# Altium schematic sheet NixieSocket.SchDoc
size A
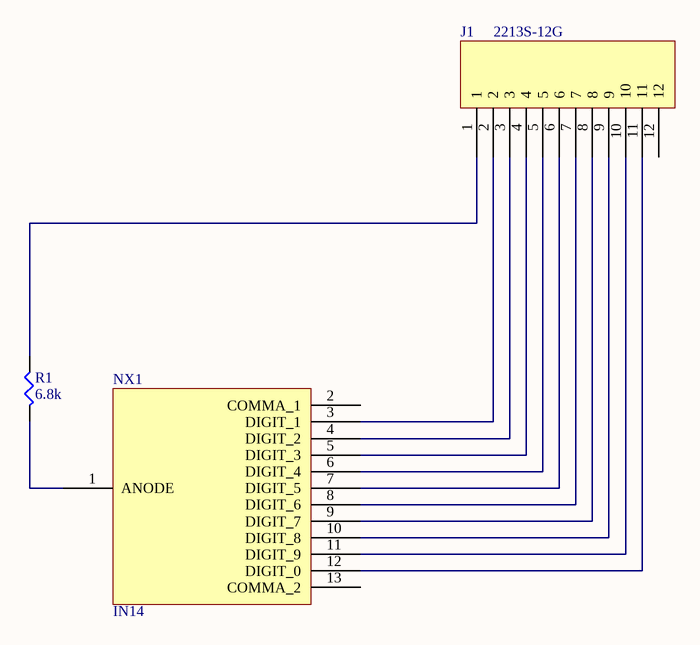
[diagram p0: NixieSocket.SchDoc]

## Parts
J1  2213S-12G  [Header 2.54mm 6x2 - Male]
NX1  IN14  [IN-14 Nixie Tube]
R1  6.8k  [SMD-0805-RES]

## Nets
NetJ1_1: J1.1 R1.1
NetJ1_2: J1.2 NX1.3(DIGIT_1)
NetJ1_3: J1.3 NX1.4(DIGIT_2)
NetJ1_4: J1.4 NX1.5(DIGIT_3)
NetJ1_5: J1.5 NX1.6(DIGIT_4)
NetJ1_6: J1.6 NX1.7(DIGIT_5)
NetJ1_7: J1.7 NX1.8(DIGIT_6)
NetJ1_8: J1.8 NX1.9(DIGIT_7)
NetJ1_9: J1.9 NX1.10(DIGIT_8)
NetJ1_10: J1.10 NX1.11(DIGIT_9)
NetJ1_11: J1.11 NX1.12(DIGIT_0)
NetNX1_1: NX1.1(ANODE) R1.2

Not connected (* = marked no-connect by the designer): J1 12; NX1 2(COMMA_1) 13(COMMA_2)

## Library data of the parts
J1 = 2213S-12G: 2213S-12G -  Board-To-Board Connector, Vertical, 2.54 mm, 12 Contacts, Header, 2213S Series, Through Hole
NX1 = IN14: IN-14 Nixie Tube
R1 = ERJ-P6WF6801V: RES SMD 6.8K OHM 1% 1/2W 0805; Manufacturer: Panasonic Electronic Components; Factory Stock: 0; Unit Price (USD): 0.10507; @ qty: 1500; Minimum Quantity: 1; Power (Watts): 0.5W, 1/2W; Temperature Coefficient: ±200ppm/°C; Part Number: ERJ-P6WF6801V; Datasheets: https://industrial.panasonic.com/cdbs/www-data/pdf/RDA0000/AOA0000C243.pdf; Image: //media.digikey.com/Renders/Panasonic%20Renders/ERJ-0805%20Pkg.jpg; Digi-Key Part Number: P16895CT-ND; Quantity Available: 5584; Packaging: Cut Tape (CT); Series: ERJ; Part Status: Active; Value: 6.8k; Tolerance: ±1%; Composition: Thick Film; Features: Automotive AEC-Q200, Pulse Withstanding; Operating Temperature: -55°C ~ 155°C; Package / Case: 0805 (2012 Metric); Supplier Device Package: 0805; Size / Dimension: 0.079" L x 0.049" W (2.00mm x 1.25mm); Height - Seated (Max): 0.030" (0.75mm); Number of Terminations: 2; Failure Rate: -